# EAGLE design Logger (EAGLE 6.5.0)
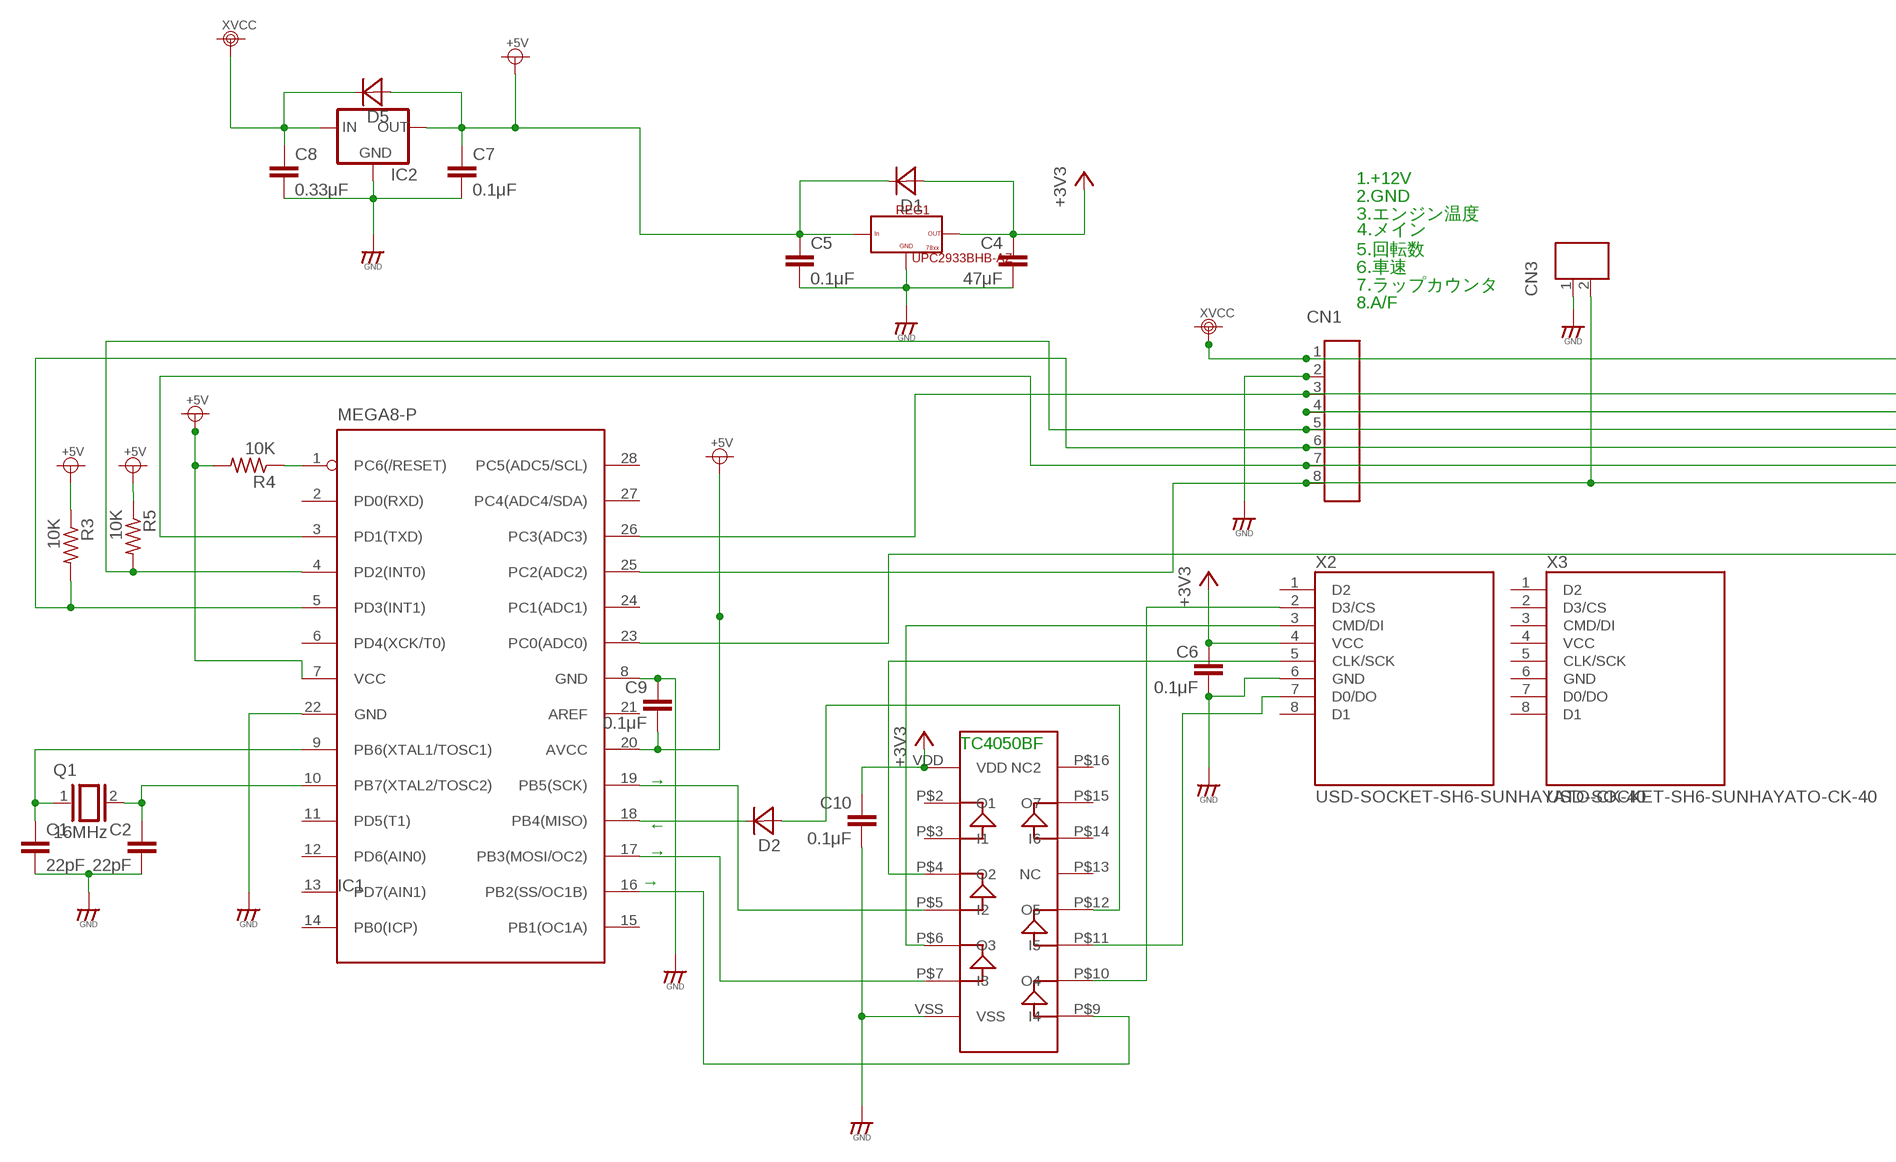
[diagram p0: schematic, sheet 1, part 1 of 2]
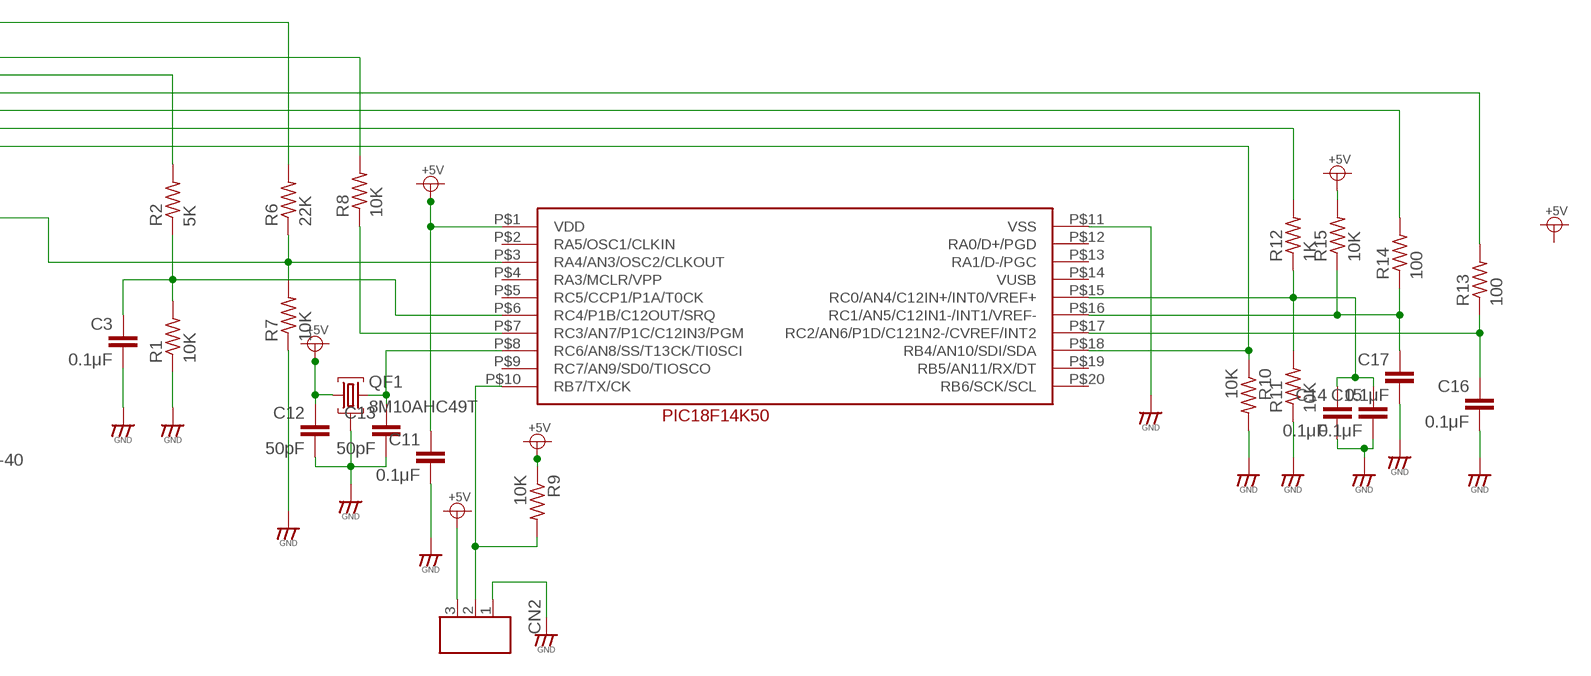
[diagram p1: schematic, sheet 1, part 2 of 2]

## Parts
C1  22pF  C-EU025-024X044  [C025-024X044]
C2  22pF  C-EU025-024X044  [C025-024X044]
C3  0.1μF  C-EU025-025X050  [C025-025X050]
C4  47μF  C-EU025-025X050  [C025-025X050]
C5  0.1μF  C-EU025-024X044  [C025-024X044]
C6  0.1μF  C-EU025-025X050  [C025-025X050]
C7  0.1μF  C-EU025-024X044  [C025-024X044]
C8  0.33μF  C-EU025-024X044  [C025-024X044]
C9  0.1μF  C-EU025-024X044  [C025-024X044]
C10  0.1μF  C-EU025-024X044  [C025-024X044]
C11  0.1μF  C-EU025-025X050  [C025-025X050]
C12  50pF  C-EU025-025X050  [C025-025X050]
C13  50pF  C-EU025-025X050  [C025-025X050]
C14  0.1μF  C-EU025-025X050  [C025-025X050]
C15  0.1μF  C-EU025-025X050  [C025-025X050]
C16  0.1μF  C-EU025-025X050  [C025-025X050]
C17  0.1μF  C-EU025-025X050  [C025-025X050]
CN1  CON_8P  [CON_HRS_DIP_8]
CN2  CON_3P  [CON_HRS_DIP_3]
CN3  CON_2P  [CON_HRS_DIP_2]
D1  DIODEGENERIC_2  [DIODE_2]
D2  DIODEGENERIC_2  [DIODE_2]
D5  DIODEGENERIC_2  [DIODE_2]
IC1  MEGA8-P  [DIL28-3]
IC2  78XX  [TO220-HORZ]
IC3  PIC18F14K50  [PIC18F14K50]
Q1  16MHz  XTAL/S  [QS]
QF1  8M10AHC49T  [HC49U]
R1  10K  R-US_0204/7  [0204/7]
R2  5K  R-US_0204/7  [0204/7]
R3  10K  R-US_0204/7  [0204/7]
R4  10K  R-US_0204/7  [0204/7]
R5  10K  R-US_0204/7  [0204/7]
R6  22K  R-US_0204/7  [0204/7]
R7  10K  R-US_0204/7  [0204/7]
R8  10K  R-US_0204/7  [0204/7]
R9  10K  R-US_0204/7  [0204/7]
R10  10K  R-US_0204/7  [0204/7]
R11  10K  R-US_0204/7  [0204/7]
R12  1K  R-US_0204/7  [0204/7]
R13  100  R-US_0204/7  [0204/7]
R14  100  R-US_0204/7  [0204/7]
R15  10K  R-US_0204/7  [0204/7]
REG1  UPC2933BHB-AZ  78XX  [78XX]
TC4050BF  HC4050  [HC4050]
X2  USD-SOCKET-SH6-SUNHAYATO-CK-40  [SUNHAYATO-CK-40]
X3  USD-SOCKET-SH6-SUNHAYATO-CK-40  [SUNHAYATO-CK-40]

## Nets
+3V3: C4.1 C6.1 C10.1 D1.A REG1.P$3 TC4050BF.VDD X2.4(VCC)
GND: C1.2 C2.2 C3.2 C4.2 C5.2 C6.2 C7.2 C8.2 C9.1 C10.2 C11.2 C12.2 C13.2 C14.2 C15.2 C16.2 C17.2 CN1.2 CN2.1 CN3.1 IC1.8(GND) IC1.22(GND) IC2.2(GND) IC3.P$11(VSS) QF1.2 R1.1 R7.1 R10.2 R11.1 REG1.P$2 TC4050BF.VSS X2.6(GND)
N$1: C1.1 IC1.9(PB6(XTAL1/TOSC1)) Q1.1
N$2: C2.1 IC1.10(PB7(XTAL2/TOSC2)) Q1.2
N$3: CN1.8 CN3.2 IC1.25(PC2(ADC2)) IC3.P$18(RB4/AN10/SDI/SDA) R10.1
N$4: CN1.6 IC1.5(PD3(INT1)) R3.2 R14.2
N$5: TC4050BF.P$10(O4) X2.2(D3/CS)
N$6: CN1.3 IC1.26(PC3(ADC3)) R8.2
N$7: C14.1 C15.1 IC3.P$15(RC0/AN4/C12IN+/INT0/VREF+) R11.2 R12.1
N$8: IC1.17(PB3(MOSI/OC2)) TC4050BF.P$7(I3)
N$9: C3.1 IC3.P$6(RC4/P1B/C12OUT/SRQ) R1.2 R2.1
N$10: TC4050BF.P$6(O3) X2.3(CMD/DI)
N$11: D2.K IC1.18(PB4(MISO))
N$12: D2.A TC4050BF.P$12(O5)
N$13: TC4050BF.P$11(I5) X2.7(D0/DO)
N$14: IC1.23(PC0(ADC0)) IC3.P$3(RA4/AN3/OSC2/CLKOUT) R6.1 R7.2
N$15: IC1.19(PB5(SCK)) TC4050BF.P$5(I2)
N$16: IC1.1(PC6(/RESET)) R4.1
N$17: TC4050BF.P$4(O2) X2.5(CLK/SCK)
N$18: IC1.16(PB2(SS/OC1B)) TC4050BF.P$9(I4)
N$19: CN1.5 IC1.4(PD2(INT0)) R5.2 R13.2
N$20: CN1.4 R2.2
N$21: IC3.P$7(RC3/AN7/P1C/C12IN3/PGM) R8.1
N$22: C13.1 IC3.P$8(RC6/AN8/SS/T13CK/TI0SCI) QF1.3
N$24: CN1.7 IC1.3(PD1(TXD)) R12.2
N$25: CN2.2 IC3.P$10(RB7/TX/CK) R9.2
N$26: C16.1 IC3.P$17(RC2/AN6/P1D/C121N2-/CVREF/INT2) R13.1
N$27: C17.1 IC3.P$16(RC1/AN5/C12IN1-/INT1/VREF-) R14.1 R15.1
VCC: C5.1 C7.1 C9.2 C11.1 C12.1 CN2.3 D1.K D5.A IC1.7(VCC) IC1.20(AVCC) IC2.3(OUT) IC3.P$1(VDD) QF1.1 R3.1 R4.2 R5.1 R9.1 R15.2 REG1.P$1 ; supply symbol labelled +5V
XVCC: C8.1 CN1.1 D5.K IC2.1(IN) R6.2
Unconnected: IC1.2(PD0(RXD)) IC1.6(PD4(XCK/T0)) IC1.11(PD5(T1)) IC1.12(PD6(AIN0)) IC1.13(PD7(AIN1)) IC1.14(PB0(ICP)) IC1.15(PB1(OC1A)) IC1.21(AREF) IC1.24(PC1(ADC1)) IC1.27(PC4(ADC4/SDA)) IC1.28(PC5(ADC5/SCL)) IC3.P$2(RA5/OSC1/CLKIN) IC3.P$5(RC5/CCP1/P1A/T0CK) IC3.P$9(RC7/AN9/SD0/TIOSCO) IC3.P$12(RA0/D+/PGD) IC3.P$13(RA1/D-/PGC) IC3.P$14(VUSB) IC3.P$19(RB5/AN11/RX/DT) IC3.P$20(RB6/SCK/SCL) TC4050BF.P$2(O1) TC4050BF.P$3(I1) TC4050BF.P$13(NC) TC4050BF.P$14(I6) TC4050BF.P$15(O7) TC4050BF.P$16(NC2) X2.1(D2) X2.8(D1) X3.1(D2) X3.2(D3/CS) X3.3(CMD/DI) X3.5(CLK/SCK) X3.7(D0/DO) X3.8(D1)

## Notes on the sheet
- 1.+12V
- 2.GND
- 3.エンジン温度
- 4.メイン
- 5.回転数
- 6.車速
- 7.ラップカウンタ
- 8.A/F
- TC4050BF
- →
- ←
- →
- →

## Power pins joined to a net without a drawn wire
+5V: X3.4(VCC)
GND: X3.6(GND)
RA3/MCLR/VPP: IC3.P$4(RA3/MCLR/VPP)

## Library data of the parts
C1-C17 = rcl:C-EU: CAPACITOR, European symbol
CN1 = da_parts:CON_8P
CN2 = da_parts:CON_3P
CN3 = da_parts:CON_2P
D1 D2 D5 = da_parts:DIODE
IC1 = atmel:MEGA8-P: MICROCONTROLLER 8 Kbytes FLASH, 1 kbytes SRAM, 512 bytes EEPROM, USART, 4-channel 10 bit ADC, 2-channel 8 bit ADC Pin compatible with Atmega48, ATMega88, ATMega168 Source: avr.lbr; OC_FARNELL: unknown; OC_NEWARK: unknown
IC2 = da_parts:78XX
IC3 = pic18f14k50:PIC18F14K50
Q1 = special:XTAL/S: CRYSTAL
QF1 = crystal-2:8M10AHC49T: Monolithic Crystal Filters Source: www.vanlong.com; OC_FARNELL: unknown; OC_NEWARK: unknown
R1-R15 = rcl:R-US_: RESISTOR, American symbol
REG1 = kitpcb:78XX
TC4050BF = HC4050BF:HC4050
X2 X3 = BS21Lab-SDcards:USD-SOCKET-SH6-: microSD Socket Push-push type uSD socket. Schematic element and footprint production proven. Spark Fun Electronics SKU : PRT-00127. tDoc lines correctly indicate media card edge positions when inserting (unlocked, locked, depressed).

## Board
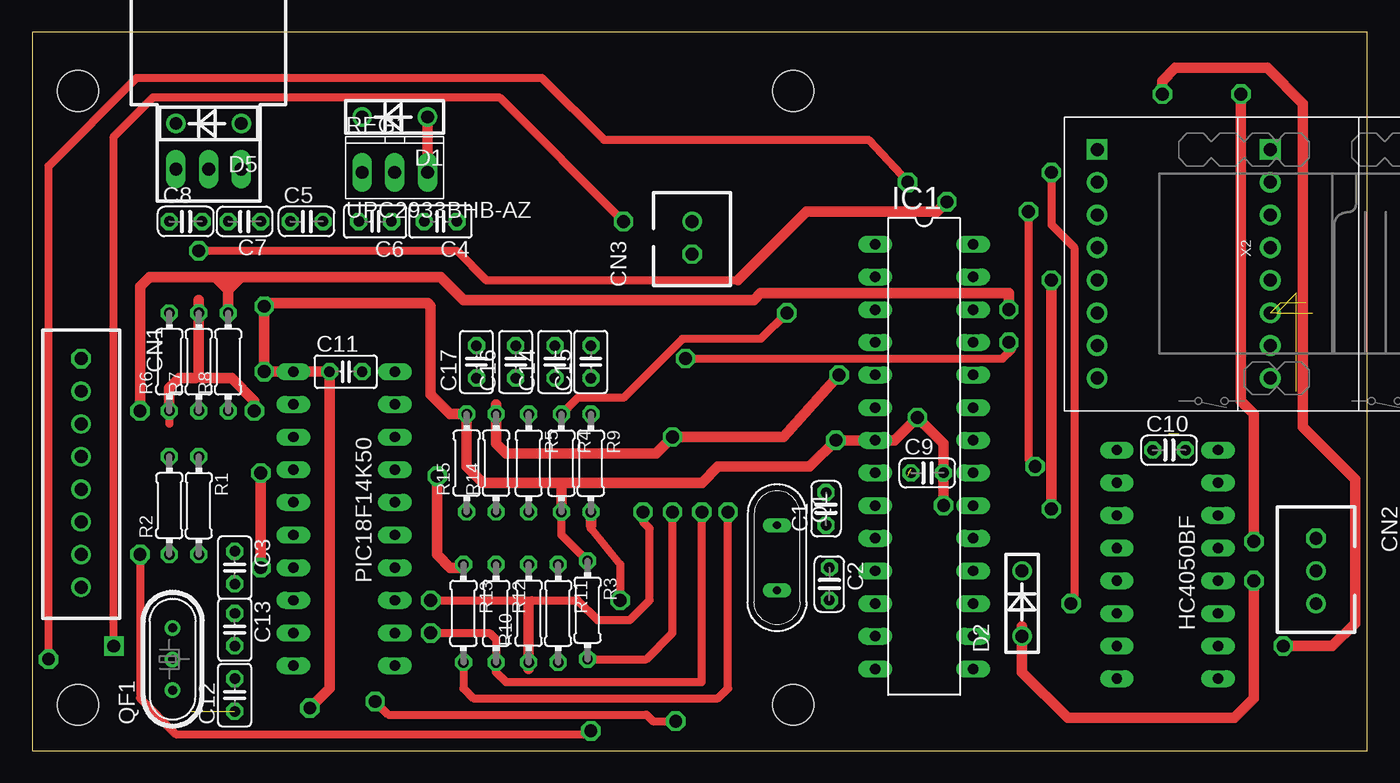
[diagram p2: board, top side]
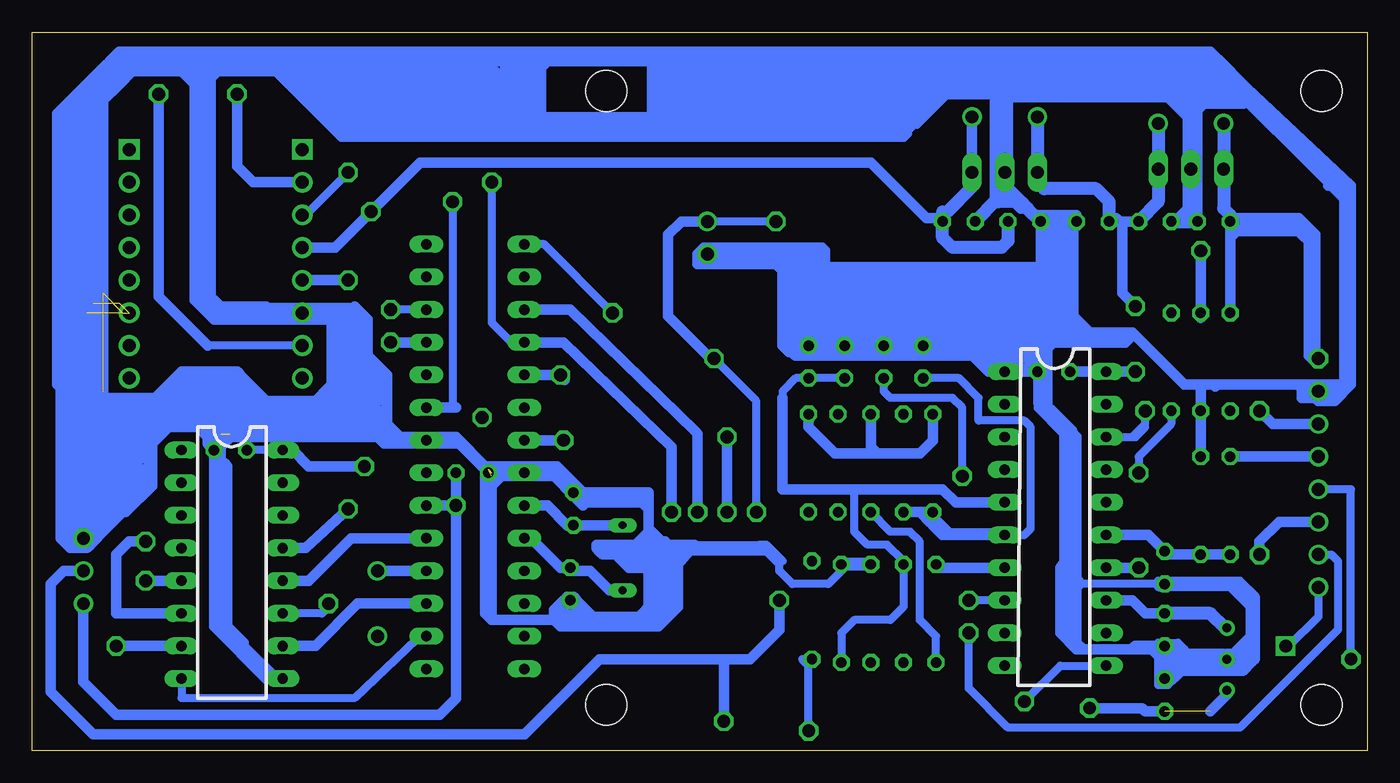
[diagram p3: board, bottom side, seen from below]

Size 103.81 x 55.87 mm. Coordinates in mm from the lower left corner, seen from the top.
Outline: 0,0 103.81,0 103.81,55.87 0,55.87 0,0
Copper layers (1*16): Top 0.035mm / dielectric 1.5mm / Bottom 0.035mm
Design rules "default": minimum track width 10mil, minimum drill 24mil, track to track 8mil, track to pad 8mil, pad to pad 8mil, via to via 8mil, smd to smd 8mil, copper to edge 40mil, drill to drill 8mil, minimum pad ring 10mil, minimum via ring 8mil, stop-mask expansion 4mil, vias tented up to drill 0mil, thermal gap 10mil
Holes 3.2 mm at 3.56,3.56 3.56,51.31 59.18,3.56 59.18,51.31

### Footprints (pad centres in the part's own frame; a part is rotated, then mirrored left to right if it is on the bottom)
C025-024X044 = drill 0.813 octagon: 1 -1.27,0; 2 1.27,0
C025-025X050 = drill 0.813 octagon: 1 -1.27,0; 2 1.27,0
CON_HRS_DIP_8 = drill 1 octagon: 1 -8.89,0 | drill 1: 2 -6.35,0; 3 -3.81,0; 4 -1.27,0; 5 1.27,0; 6 3.81,0; 7 6.35,0; 8 8.89,0
CON_HRS_DIP_3 = drill 1 octagon: 1 -2.54,0 | drill 1: 2 0,0; 3 2.54,0
CON_HRS_DIP_2 = drill 1 octagon: 1 -1.27,0 | drill 1: 2 1.27,0
DIODE_2 = drill 1: A -2.54,0; K 2.54,0
DIL28-3 = drill 0.813 long: 1 -16.51,-3.81; 2 -13.97,-3.81; 3 -11.43,-3.81; 4 -8.89,-3.81; 5 -6.35,-3.81; 6 -3.81,-3.81; 7 -1.27,-3.81; 8 1.27,-3.81; 9 3.81,-3.81; 10 6.35,-3.81; 11 8.89,-3.81; 12 11.43,-3.81; 13 13.97,-3.81; 14 16.51,-3.81; 15 16.51,3.81; 16 13.97,3.81; 17 11.43,3.81; 18 8.89,3.81; 19 6.35,3.81; 20 3.81,3.81; 21 1.27,3.81; 22 -1.27,3.81; 23 -3.81,3.81; 24 -6.35,3.81; 25 -8.89,3.81; 26 -11.43,3.81; 27 -13.97,3.81; 28 -16.51,3.81
TO220-HORZ = drill 1 long: 1 0,-2.54; 2 0,0; 3 0,2.54
PIC18F14K50 = drill 0.8 long: P$1 -5.08,10.16; P$2 -5.08,7.62; P$3 -5.08,5.08; P$4 -5.08,2.54; P$5 -5.08,0; P$6 -5.08,-2.54; P$7 -5.08,-5.08; P$8 -5.08,-7.62; P$9 -5.08,-10.16; P$10 -5.08,-12.7; P$11 2.794,10.16; P$12 2.794,7.62; P$13 2.794,5.08; P$14 2.794,2.54; P$15 2.794,0; P$16 2.794,-2.54; P$17 2.794,-5.08; P$18 2.794,-7.62; P$19 2.794,-10.16; P$20 2.794,-12.7
QS = drill 0.61 long: 1 -2.54,0; 2 2.54,0
HC49U = drill 0.7 pad 1.2: 1 -2.413,0; 2 -0.027,0; 3 2.413,0
0204/7 = drill 0.813 octagon: 1 -3.81,0; 2 3.81,0
78XX = drill 1 long: P$1 0,0; P$2 2.54,0; P$3 5.08,0
HC4050 = drill 0.8 long: P$2 -5.08,7.62; P$3 -5.08,5.08; P$4 -5.08,2.54; P$5 -5.08,0; P$6 -5.08,-2.54; P$7 -5.08,-5.08; P$9 2.794,-7.62; P$10 2.794,-5.08; P$11 2.794,-2.54; P$12 2.794,0; P$13 2.794,2.54; P$14 2.794,5.08; P$15 2.794,7.62; P$16 2.794,10.16; VDD -5.08,10.16; VSS -5.08,-7.62
SUNHAYATO-CK-40 = drill 1.016 pad 1.6 square: 1 0,0 | drill 1.016 pad 1.6: 2 2.54,0; 3 5.08,0; 4 7.62,0; 5 10.16,0; 6 12.7,0; 7 15.24,0; 8 17.78,0

### Placement (x,y rotation side)
C1  61.72,18.8 90 top
C2  61.98,12.95 270 top
C3  15.75,14.22 270 top
C4  31.75,41.15 180 top
C5  21.34,41.15 0 top
C6  26.67,41.15 180 top
C7  16.51,41.15 180 top
C8  11.94,41.15 0 top
C9  69.6,21.59 0 top
C10  88.39,23.37 0 top
C11  24.38,29.46 0 top
C12  15.75,4.32 90 top
C13  15.75,9.4 270 top
C14  40.64,30.23 90 top
C15  43.43,30.23 90 top
C16  37.59,30.23 90 top
C17  34.54,30.23 90 top
CN1  3.81,21.59 270 top
CN2  99.82,13.97 270 top
CN3  51.31,39.88 90 top
D1  28.19,49.28 180 top
D2  76.96,11.43 90 top
D5  13.72,48.77 180 top
IC1  69.34,22.86 270 top
IC2  13.72,45.21 270 top
IC3  25.4,19.3 0 top
Q1  57.91,14.99 270 top
QF1  10.92,7.11 90 top
R1  12.95,19.05 270 top
R2  10.67,19.05 90 top
R3  43.18,10.92 270 top
R4  41.15,22.35 270 top
R5  38.61,22.35 270 top
R6  10.67,30.23 90 top
R7  12.95,30.23 90 top
R8  15.24,30.23 90 top
R9  43.43,22.35 270 top
R10  38.61,10.67 90 top
R11  40.89,10.67 270 top
R12  36.07,10.67 270 top
R13  33.53,10.67 270 top
R14  36.07,22.35 90 top
R15  33.78,22.35 90 top
REG1  25.65,44.96 0 top
TC4050BF  89.41,13.21 0 top
X2  82.8,46.74 270 top
X3  96.27,46.74 270 top

### Tracks (layer width: path | path; a pad name or v marks a point on that pad's centre or on a via)
+3V3  (via drill 1)
  Top 0.61: v77.47,41.91 77.47,22.61 v77.98,22.1
  Top 0.813: REG1.P$3 D1.A
  Bottom 0.61: 83.57,23.37 TC4050BF.VDD C10.1
  Bottom 0.813: 33.02,41.91 32.51,41.91 30.73,43.69 D1.A | 30.99,45.72 30.99,43.69 33.02,41.66 C4.1 33.27,41.4 34.29,41.4 38.61,45.72 73.66,45.72 v77.47,41.91 80.26,39.12 X2.4 | v77.98,22.1 82.3,22.1 83.57,23.37
  Bottom 1.016: REG1.P$3 30.73,44.2 | 33.02,41.91 C4.1 33.02,39.88 32.26,39.12 28.45,39.12 27.94,39.62 C6.1
GND  (9 unrouted)
  Bottom 0.61: C13.2 15.49,8.13 14.99,7.62 11.18,7.62 10.67,7.11 11.43,6.35 | 11.43,6.35 11.68,6.35 | 14.48,6.35 15.49,6.35 | 11.43,6.35 10.92,6.35 | 10.92,6.35 9.65,7.62 | 10.92,7.62 9.65,7.62 | 9.65,7.62 9.14,8.13 9.14,11.18 10.67,12.7 14.48,12.7 | 14.48,12.7 14.48,13.21 10.67,13.21 8.89,11.43 8.89,9.14 | 9.14,7.11 9.91,6.35 10.41,6.35 | 10.92,6.35 10.41,6.35 | 10.41,6.35 9.14,7.62 8.89,7.37 | 8.89,7.37 8.89,6.86 | 8.89,6.86 9.65,6.1 14.22,6.1 | 14.48,6.1 14.99,6.1 14.99,5.59 | 14.99,5.59 15.49,5.08 | 15.49,5.08 16.26,5.08 16.26,7.37 16.26,8.38 14.73,8.38 14.22,7.87 14.22,6.1 | 14.22,6.1 14.48,6.1 | 14.48,6.1 14.99,5.59 | 15.49,5.08 15.49,5.33 14.48,6.35 | 14.48,6.35 11.68,6.35 | 11.68,6.35 8.89,9.14 | 8.89,9.14 8.89,7.37 | 8.89,7.37 9.14,7.11 | 9.14,7.11 8.89,6.86 | 8.89,6.86 8.64,7.11 8.64,11.94 9.91,13.21 16.26,13.21 16.26,12.7 15.49,12.7 | 14.48,12.7 15.49,12.7 | 15.49,12.7 C3.2 22.35,12.95 23.37,13.97 23.37,24.64 25.65,26.92 25.65,28.45 | 25.4,28.45 25.4,26.92 25.15,26.67 | 25.15,26.67 24.89,26.67 24.64,26.67 22.86,24.89 22.86,13.72 22.35,13.21 22.61,13.21 | 23.62,24.64 25.65,26.67 25.15,26.67 | 25.15,26.67 24.89,26.92 24.89,28.45 25.4,28.45 | 25.4,28.45 25.65,28.45 | 25.65,28.45 C11.2 | 52.32,16 47.24,16 | 45.47,14.73 46.74,16 47.24,16 | 47.24,16 46.74,15.49 | 53.09,15.49 46.74,15.49 | 46.74,15.49 45.72,14.48 45.72,13.97 44.7,12.95 41.91,12.95 40.89,13.97 R11.1 | 23.62,14.22 23.62,14.48 23.62,25.15 25.15,26.67 | 25.15,26.67 25.15,29.21 26.42,30.48 26.42,32.26 | 26.42,32.77 26.42,32.26 | 26.42,32.26 26.92,31.75 26.92,32 27.18,32.26 27.18,31.75 26.92,31.5 26.42,31.5 25.65,32.26 25.65,32.77 26.42,32.77 | 26.42,32.77 42.16,32.77 44.2,32.77 44.45,32.51 44.96,32 44.96,30.99 44.7,30.99
  Bottom 0.61: 72.14,48.26 79.5,48.26 84.58,53.34 85.34,53.34 | 42.42,37.85 42.42,34.29 42.42,31.75 | 85.6,34.54 78.74,34.54
  Bottom 0.813: C11.2 IC3.P$11 29.46,29.46 30.99,30.99 C16.2 | C16.2 C17.2 C14.2 C15.2 | 63.5,21.59 IC1.8 68.07,21.59 | 63.25,21.59 C1.2 60.96,20.07 | 60.96,20.07 55.88,20.07 55.88,18.8 | 55.37,10.92 55.37,10.41 55.88,9.91 61.21,9.91 61.72,10.41 | 61.72,10.41 61.72,11.43 | 61.72,11.43 C2.2 | 55.12,14.48 55.12,15.75 53.59,15.75 | 55.12,14.48 55.12,10.16 55.63,9.65 | 55.63,9.65 61.21,9.65 | 61.21,9.65 61.72,10.16 61.72,10.41 | 61.72,10.41 60.45,10.41 | 56.64,10.41 55.88,10.41 55.37,10.92 | 55.37,10.92 55.63,10.92 55.88,10.67 55.88,14.22 | 60.96,19.05 61.47,19.56 | 61.47,19.56 57.15,19.56 56.9,19.3 | 60.2,19.3 60.96,20.07 | 60.96,20.07 62.48,21.59 | 62.48,21.59 63.25,21.59 | 63.25,21.59 63.5,21.59 | 63.5,21.59 63.25,21.34 | 61.72,19.81 61.47,19.56 | 55.63,11.43 56.64,10.41 | 60.2,10.41 60.45,10.41 | 60.45,10.41 61.21,9.65 | 61.21,9.65 62.23,9.65 | 62.23,10.16 62.23,11.94 61.72,11.94 | 61.72,11.68 61.72,11.43 | 61.72,11.43 61.47,11.18 61.47,11.68 | 61.47,11.68 61.72,11.94 | 61.72,11.94 61.72,11.68 | 60.45,10.41 61.72,11.68 | 61.72,11.68 61.47,11.68 | 61.47,11.68 60.2,10.41 | 60.2,10.41 56.64,10.41 | 52.83,15.75 53.59,15.75 | 54.61,16.26 54.86,16 53.85,16 | 52.32,16 53.85,16 | 53.85,16 53.85,15.75 55.12,14.48 | 55.12,14.48 54.86,14.48 53.59,15.75 | 53.59,15.75 53.59,14.99 | 53.59,14.99 53.59,11.18 55.12,9.65 55.63,9.65 | 55.63,9.65 55.63,9.91 54.36,11.18 54.36,13.72 | 54.36,14.73 54.36,13.72 | 54.36,13.72 53.85,13.21 53.85,14.22 52.32,16 | 52.32,16 52.83,15.75 | 52.83,15.75 53.09,15.49 53.59,14.99 | 53.59,14.99 54.86,14.99 56.13,16.26 56.13,16 | 56.13,16 56.9,16 | 56.9,16 59.69,16 59.69,15.75 56.9,15.75 | 56.9,15.75 56.39,15.75 56.13,16 | 56.13,16 56.13,15.49 59.69,15.49
  Bottom 0.813: 59.69,15.49 59.94,15.75 59.94,16 57.4,16 56.13,14.73 56.13,14.99 56.9,15.75 | 56.9,15.75 55.88,16.76 | 55.88,16.76 55.88,14.22 | 55.88,14.22 57.4,14.22 58.17,14.99 57.4,14.99 57.15,14.73 | 57.15,14.73 56.64,14.73 | 57.15,14.73 57.91,14.73 58.42,15.24 59.44,15.24 59.69,15.49 | C7.2 14.99,41.15 13.97,42.16 13.97,49.28 16,51.31 26.92,51.31 | 27.43,51.82 27.94,51.31 27.94,50.55 | 27.43,51.82 27.18,51.82 | 27.18,51.82 15.75,51.82 | 15.75,51.82 13.72,49.78 13.72,41.66 C8.2 13.21,49.78 12.7,50.29 10.16,50.29 | 15.49,51.82 15.75,51.82 | 27.43,51.82 27.69,51.82 | 27.69,51.82 28.96,50.55 28.96,42.93 28.83,42.8 | 27.94,45.72 27.94,50.55 | 27.94,50.55 27.18,51.31 27.43,51.31 28.45,50.29 28.45,45.97 28.19,45.72 27.94,45.72 | 27.94,45.72 27.94,43.94 28.19,43.69 REG1.P$2 28.7,45.47 | 28.7,45.47 28.7,43.43 | 28.7,45.47 28.7,50.29 27.18,51.82 | 27.69,51.82 32.51,51.82 | 32.51,51.82 35.05,49.28 35.05,48.77 32.77,51.05 | 32.77,51.05 29.21,51.05 | 29.21,51.05 28.7,51.05 | 28.7,51.05 28.45,51.31 | 28.45,51.31 28.7,51.31 | 28.7,51.31 32,51.31 32.51,51.82 | 32.51,51.82 33.53,51.82 | 33.53,51.82 35.31,50.04 | 35.31,50.04 35.31,49.78 | 35.31,49.78 35.31,48.77 | C16.2 27.18,30.99 | 27.18,30.99 26.92,30.99 | 26.92,30.99 26.67,30.73 | 26.67,30.73 26.42,30.48 25.65,29.72 28.96,29.72 29.46,30.23 | 29.46,30.23 29.97,30.73 | 29.97,30.73 28.7,30.73 | 28.7,30.73 27.18,30.73 | 27.18,30.73 26.92,30.48 29.21,30.48 29.46,30.23 | 29.46,30.23 27.94,30.23 27.18,30.99 | 27.18,30.99 27.18,31.24 27.43,31.5 | 27.43,31.5 39.62,31.5 | 39.62,31.5 C15.2 | C15.2 43.69,31.24 43.69,31.75 | 43.69,31.75 43.18,31.75 | 43.18,31.75 42.42,31.75 39.88,31.75 | 39.88,31.75 27.69,31.75
  Bottom 0.813: 27.69,31.75 27.43,31.5 | 27.69,31.75 27.94,32 35.05,32 34.8,32.26 43.69,32.26 44.2,32.77 43.43,32.77 | TC4050BF.VSS 85.6,5.59 89.66,9.65 C10.2 88.14,24.89 | 82.55,25.15 87.88,25.15 | 87.88,25.15 88.14,24.89 | 97.28,22.86 95,25.15 | 90.42,25.15 87.88,25.15 | 95,25.15 94.23,25.15 | 90.93,25.15 90.42,25.15 | 90.42,25.15 90.17,24.89 90.17,24.64 | 90.17,24.38 90.17,23.88 89.92,23.62 89.41,24.13 89.41,24.38 | 89.41,24.38 89.15,24.64 89.66,24.64 | 88.14,24.89 89.92,24.89 90.17,24.64 | 90.17,24.64 90.17,24.38 | 90.17,24.38 90.93,25.15 | 95,25.15 95.5,25.15 | 95.5,25.15 97.28,23.37 97.28,22.86 | 99.57,21.34 99.82,21.08 CN2.1 99.31,17.02 99.31,20.83 97.28,22.86 | 68.07,21.59 C9.1 | C9.1 68.83,22.1 | 68.83,22.1 70.61,23.88 | 70.61,23.88 70.87,24.13 IC1.22 | 90.17,25.65 89.41,25.65 89.15,25.91 | 95.5,25.15 95,25.65 83.82,25.65 83.82,26.92 84.84,25.91 | 90.93,25.15 94.23,25.15 | 94.23,25.15 95,25.91 93.98,25.91 | 93.98,25.91 89.15,25.91 | 84.84,25.91 83.31,25.91 82.55,25.15 | 89.15,25.91 84.84,25.91 | 93.73,27.18 99.57,21.34 | 99.57,21.34 99.31,21.34 94.23,26.42 | 94.23,26.42 85.85,26.42 | 85.85,26.42 85.6,26.42 | 85.6,26.42 85.34,26.67 | 85.34,26.67 86.11,26.67 | 86.11,26.67 86.36,26.67 | 86.36,26.67 87.12,27.43 87.12,28.7 | 87.12,28.7 87.63,29.21 | 87.63,29.21 87.88,29.46 91.69,29.46 | 91.69,29.46 94.49,26.67 93.47,26.67 91.95,28.19 87.88,28.19 87.38,27.69 92.2,27.69 92.46,27.43 92.46,27.94 91.44,28.96 87.63,28.96 87.38,28.7 87.38,27.94 86.11,26.67 | 86.36,26.67 87.12,26.67 | 87.12,26.67 92.96,26.67 98.04,21.59 98.04,17.78 99.31,16.51 99.31,19.81 98.81,20.32 98.81,20.57 98.55,20.83 98.55,17.53 98.81,17.27 98.55,17.27 97.28,18.54 97.03,18.54
  Bottom 0.813: 97.03,18.54 96.52,18.54 94.49,20.57 94.49,24.38 | 94.49,24.89 94.49,24.38 | 94.49,24.38 97.54,21.34 97.54,18.03 97.79,18.03 99.82,16 99.31,16 | 99.31,16 98.04,17.27 | 98.04,17.27 96.52,18.8 96.52,19.3 94.74,21.08 94.74,23.11 95,23.11 97.03,21.08 97.03,19.81 | 97.03,18.54 97.03,19.81 | 97.03,19.81 96.27,20.57 96.27,20.83 95.25,21.84 95.25,21.08 95.76,20.57 95.76,22.61 92.96,25.4 95.5,25.4 100.08,20.83 100.08,19.81 | 100.08,16.51 100.08,19.81 | 100.08,19.81 93.98,25.91 | 77.98,33.02 78.49,33.53 | 83.06,26.42 85.6,26.42 | 94.23,26.42 98.55,26.42 | 98.55,26.42 99.06,26.42 | 99.06,26.42 99.82,26.42 101.85,28.45 101.85,49.53 98.04,53.34 97.79,53.34 | 97.79,53.34 85.34,53.34 | 72.14,48.26 35.81,48.26 | 35.81,48.26 35.31,48.77 | 1.78,42.93 3.56,44.7 | 10.41,51.56 10.16,51.56 | 10.16,51.56 9.65,51.56 | 9.4,51.56 1.27,43.94 1.27,29.21 | 3.3,44.7 2.03,44.2 3.05,43.94 | 3.3,44.7 3.56,44.7 | 3.56,44.7 10.41,51.56 | 10.41,51.56 10.92,52.07 | 10.92,52.07 10.16,52.07 | 10.16,52.07 9.91,52.07 | 9.91,52.07 9.4,51.56 | 9.4,51.56 9.65,51.56 | 9.65,51.56 10.16,52.07 | 10.92,52.07 33.27,52.07 | 33.27,52.07 33.53,51.82 | 9.65,50.29 10.16,50.29 | 10.16,50.29 10.67,50.8 13.21,50.8 13.72,50.29 13.72,50.55 14.73,51.56 | 14.73,51.56 10.92,51.56 | 10.92,51.56 10.41,51.05 | 10.41,51.05 13.72,51.05 | 10.41,51.05 10.16,51.05 | 3.3,44.7 10.16,51.56 | 10.41,51.56 10.92,51.56 | 14.73,51.56 15.24,51.05 28.7,51.05 | 55.88,16.76 55.63,16.76 55.12,16.26 55.12,16.51 | 55.12,16.51 55.88,17.27 | 55.88,17.27 55.88,18.8 | 60.2,19.3 56.39,19.3 55.88,18.8 | 60.71,19.3 60.2,19.3 | 55.88,17.27 55.88,17.02 56.9,16 | 56.13,16 55.63,16 55.12,16.51 | IC1.22 75.18,24.13 75.95,24.89 82.3,24.89 82.55,25.15
  Bottom 0.813: 83.06,26.92 83.06,26.42 | 83.06,26.42 82.3,25.65 76.71,25.65 76.2,25.15 76.2,26.16 77.47,26.16 | 77.47,26.16 82.3,26.16 | 82.3,26.16 82.55,26.42 76.2,26.42 76.2,27.18 76.45,27.18 | 76.2,27.94 76.2,27.43 76.45,27.18 | 76.2,27.94 78.49,27.94 78.49,27.69 75.18,24.38 | 76.2,28.7 76.2,27.94 | 76.45,27.18 76.45,28.45 76.2,28.7 | 76.2,28.7 76.2,28.96 76.45,28.96 76.2,29.21 77.72,30.73 77.72,33.53 78.23,34.04 | 78.23,33.78 78.23,30.73 | 78.74,30.99 78.74,31.5 78.99,31.75 80.26,31.75 78.49,33.53 | 78.49,33.53 78.23,33.78 | 78.23,33.78 78.23,34.04 | 78.23,34.04 78.74,34.54 | 86.11,33.53 86.11,34.29 85.85,34.54 85.85,34.29 85.6,34.54 85.6,34.04 | 71.12,24.38 70.87,24.38 68.58,22.1 | 68.07,21.59 68.07,21.34 | 68.07,21.34 67.31,21.34 | 67.31,21.34 63.25,21.34 | 63.25,21.34 61.72,19.81 | 61.72,19.81 61.72,20.32 62.48,21.08 | 68.07,21.34 67.82,21.08 68.33,21.08 68.58,21.34 68.58,10.92 67.82,10.16 | 68.07,21.34 C9.1 | IC1.22 75.44,24.13 75.69,24.38 | 75.69,24.38 77.47,26.16 | 82.3,26.16 92.2,26.16 93.47,27.43 | 91.69,29.46 92.2,29.46 95,26.67 99.57,26.67 99.82,26.92 | 3.05,43.94 1.78,43.69 1.78,42.93 | 1.78,42.93 1.78,28.7 | 1.78,28.7 2.03,28.45 | 2.03,28.45 2.54,27.94 3.3,27.94 3.3,27.18 | 3.3,27.18 2.54,27.18 1.27,28.45 1.27,29.21 | 1.27,29.21 1.78,28.7 | 2.03,28.45 4.32,28.45 | 4.32,28.45 4.32,28.19 | 4.32,28.19 CN1.2 | 4.32,28.19 4.32,27.69 | 4.32,27.69 3.81,27.18 3.3,27.18 | 4.32,27.69 4.57,27.94 4.57,28.45 | 4.57,28.45 4.32,28.45 | 4.57,28.45 5.08,28.45 5.08,28.19 | 3.56,27.43 5.08,27.43 5.08,28.19 | 43.94,30.73 43.94,31.24 43.69,31.5 C15.2 | 28.96,30.48 28.7,30.73 | 29.97,30.73 44.45,30.73 44.7,30.99 44.7,31.5 44.45,31.75 43.69,31.75
  Bottom 0.813: 39.88,31.75 39.62,31.5 | 5.08,28.19 5.33,28.45 11.68,28.45 11.81,28.32 11.94,28.45 12.7,28.45 | 44.7,31.75 44.2,32.26 45.47,32.26 | 99.82,26.92 101.6,28.7 101.6,49.53 98.04,53.09 | 97.79,53.34 97.79,53.09 | 97.79,53.09 100.84,50.04 | 100.84,50.04 101.09,49.78 101.09,27.94 101.6,28.45 101.6,16.51 100.84,15.75 99.57,15.75 99.31,16 | 98.04,17.27 99.82,17.27 100.58,16.51 100.84,16.76 100.84,26.92 | 100.84,26.92 101.35,27.43 | 100.84,26.92 100.08,26.16 100.08,21.08 99.57,21.59 99.57,25.91 99.31,26.16 99.06,26.16 98.81,25.91 98.81,23.11 99.31,22.61 99.06,22.61 98.3,23.37 98.3,25.91 98.04,26.16 97.54,26.16 97.54,24.13 | 97.54,24.13 97.79,23.88 | 97.54,24.13 97.28,24.38 97.28,25.91 96.01,25.91 | 95.25,25.91 96.01,25.91 | 96.01,25.91 97.03,24.89 97.54,24.89 99.06,26.42 | 99.06,26.42 99.82,27.18 | 99.82,27.18 99.82,27.69 | 99.82,27.69 100.33,28.19 100.33,50.29 100.08,50.55 99.82,50.55 99.31,51.05 99.31,50.55 99.82,50.04 99.82,33.78 | 99.82,27.18 99.82,26.92 | 99.82,26.92 95.25,26.92 95,27.18 94.74,27.18 94.49,27.43 99.06,27.43 99.31,27.69 99.31,50.8 98.04,52.07 98.04,51.31 98.81,50.55 98.81,27.94 98.3,27.94 98.3,51.56 | 98.3,51.56 98.3,51.82 97.28,52.83 97.28,51.56 | 97.28,51.56 98.04,50.8 | 97.28,51.56 95.76,53.09 | 95.76,53.09 96.77,53.09 | 96.77,53.09 97.03,52.83 | 92.2,52.83 90.42,52.83 90.42,34.54 | 90.42,34.54 89.92,34.54 89.92,35.05 | 89.92,53.09 89.92,35.05 | 89.92,35.05 90.42,34.54 | 90.42,34.54 90.42,34.29 89.66,33.53 88.14,33.53 | 86.87,33.53 86.87,34.04 89.41,34.04 89.41,34.29 89.66,34.54 86.11,34.54 86.11,33.78 86.36,33.53 86.87,33.53 | 86.87,33.53 88.14,33.53 | 88.14,33.53 89.66,35.05 89.92,35.05
  Bottom 0.813: 89.92,35.05 90.17,35.31 90.17,52.07 | 88.9,53.34 90.17,52.07 | 90.17,52.07 90.68,52.07 91.19,52.58 | 91.19,52.58 91.69,53.09 | 35.31,32.51 28.45,32.51 | 28.45,32.51 26.92,30.99 | 26.67,30.73 27.18,30.73 | 27.18,30.73 28.7,32.26 28.45,32.51 | 28.45,32.51 23.88,32.51 | 23.88,32.51 21.59,32.51 | 21.34,32.51 18.29,32.51 14.22,28.45 12.7,28.45 | 43.43,32.77 42.93,33.27 42.93,38.1 43.18,38.35 42.93,38.35 42.42,37.85 42.42,38.35 | 42.16,38.61 42.16,33.27 | 42.16,32.77 43.43,32.77 | 43.43,32.77 43.69,33.02 43.69,38.86 | 45.47,32.26 45.47,32.51 | 45.47,32.51 45.47,38.61 | 45.47,38.61 45.21,38.61 44.7,38.1 | 44.7,38.1 44.7,33.27 44.96,33.02 | 44.45,32.51 44.45,33.27 44.2,33.53 44.2,37.85 44.45,37.85 44.7,38.1 | CN3.1 45.47,38.61 | 44.7,38.61 42.16,38.61 | 42.16,38.61 42.16,38.86 42.42,39.12 51.56,39.12 52.07,38.61 52.07,37.85 45.97,37.85 45.21,37.08 45.21,32.77 45.47,32.51 | 45.47,32.26 45.47,31.5 44.96,30.99 43.94,30.99 43.18,31.75 | 98.04,53.09 97.28,53.85 84.58,53.85 | 84.58,53.85 84.33,53.85 | 84.33,53.85 79.25,48.77 78.74,48.77 | 78.74,48.77 77.72,48.77 | 77.72,48.77 76.45,48.77 | 76.45,48.77 72.9,48.77 | 72.14,48.77 65.02,48.77 | 65.02,48.77 36.32,48.77 35.31,49.78 | 35.31,50.04 35.31,50.29 33.53,52.07 34.04,52.07 36.58,49.53 55.37,49.53 55.63,49.28 37.34,49.28 36.07,50.55 54.61,50.55 | 54.61,50.55 54.86,50.29 | 54.86,50.29 55.88,49.28 | 55.88,49.28 56.64,48.51 56.13,48.51 54.36,50.29 37.34,50.29 37.08,50.04 36.58,50.04 34.54,52.07 | 34.54,52.07 33.27,52.07 | 34.54,52.07 34.8,52.07 | 34.8,52.07 35.56,51.31 | 36.58,50.29 35.56,51.31 | 35.56,51.31 53.85,51.31 | 53.85,51.31 54.1,51.05 | 53.59,51.56 53.09,52.07
  Bottom 0.813: 53.09,52.07 34.8,52.07 | 34.54,52.07 34.54,49.53 35.31,48.77 | 35.81,48.26 35.81,48.01 36.07,47.75 79.76,47.75 82.8,50.8 | 84.84,52.83 85.34,53.34 | 85.34,53.34 85.09,53.34 84.58,53.85 | 84.33,53.85 83.82,53.85 | 83.82,53.85 78.74,48.77 | 78.74,48.77 78.74,49.28 83.31,53.85 | 83.31,53.85 83.82,53.85 | 83.31,53.85 82.55,53.85 82.04,53.34 82.04,53.09 77.72,48.77 | 77.72,48.77 77.72,49.53 82.04,53.85 | 82.04,53.85 82.3,53.85 | 82.04,53.85 68.83,53.85 64.77,49.78 | 64.77,49.78 64.77,49.28 | 64.77,49.28 64.77,49.02 65.02,48.77 | 65.02,48.77 65.02,49.02 69.34,53.34 80.52,53.34 80.77,53.09 76.45,48.77 | 76.45,48.77 76.45,49.78 79.5,52.83 | 79.5,52.83 80.01,52.83 | 79.5,52.83 78.49,52.83 78.49,52.07 75.44,49.02 74.42,49.02 74.42,49.28 78.23,53.09 78.23,52.58 75.18,49.53 73.66,49.53 73.41,49.28 73.91,49.28 77.47,52.83 76.2,52.83 76.2,52.07 72.9,48.77 | 72.9,48.77 72.14,48.77 | 72.14,48.77 72.14,49.02 76.2,53.09 75.44,53.09 74.93,52.58 74.93,52.32 71.88,49.28 71.12,49.28 | 67.82,49.28 66.29,49.28 66.04,49.53 66.55,49.53 69.85,52.83 74.42,52.83 74.68,52.58 74.42,52.58 71.12,49.28 | 71.12,49.28 67.82,49.28 | 67.82,49.28 67.56,49.53 70.1,52.07 73.15,52.07 | 73.15,52.07 73.41,52.32 | 73.15,52.07 70.87,49.78 68.83,49.78 | 68.83,49.78 68.58,49.53 | 68.83,49.78 70.61,51.56 72.14,51.56 | 72.39,51.56 72.14,51.56 | 72.14,51.56 70.61,50.04 70.36,50.04 70.1,50.29 70.61,50.29 71.37,51.05 70.87,51.05 70.61,50.8 | 70.36,50.55 70.61,50.8 | 70.61,50.8 82.8,50.8 | 82.8,50.8 84.84,52.83 | 84.84,52.83 91.95,52.83 92.2,53.09 95.76,53.09 | 96.77,53.09 97.28,53.59 | 97.28,53.59 97.79,53.09 | 27.69,31.75 18.8,31.75 18.54,32 23.37,32 23.88,32.51
  Bottom 0.813: 23.88,32.51 23.88,40.39 23.62,40.64 | 23.62,40.64 23.88,40.64 | 23.88,40.64 24.38,40.64 24.38,32.77 | 24.38,32.77 23.37,32.77 | 23.37,32.77 23.11,32.77 22.86,33.02 22.86,33.78 | 22.86,35.56 22.86,40.39 23.11,40.39 23.11,33.02 23.37,32.77 | 24.38,32.77 25.15,32.77 25.4,33.02 25.15,33.27 25.15,40.13 24.89,40.39 25.15,40.39 25.4,40.64 25.4,33.78 26.42,32.77 22.86,32.77 22.35,32.26 21.59,32.26 21.34,32.51 | 21.34,32.51 21.59,32.51 | 21.59,32.51 22.86,33.78 | 22.86,33.78 22.86,35.56 | 22.86,35.56 24.89,37.59 41.91,37.59 41.91,36.83 25.91,36.83 25.65,37.08 25.65,36.58 26.16,36.07 41.66,36.07 41.91,36.32 41.91,35.56 41.66,35.31 26.16,35.31 25.91,35.56 25.91,35.05 42.16,35.05 42.67,34.54 42.42,34.29 25.91,34.29 25.91,33.53 26.42,33.02 41.91,33.02 42.16,32.77 | 42.16,32.77 42.16,33.27 | 42.16,33.27 41.91,33.53 26.42,33.53 26.16,33.78 40.64,33.78 44.96,38.1 | 3.05,43.94 3.05,44.96 8.89,50.8 28.96,50.8 29.21,51.05 | 32.77,51.05 54.1,51.05 | 54.1,51.05 54.61,50.55 | 55.88,49.28 64.77,49.28 | 64.77,49.28 68.33,49.28 68.58,49.02 79.25,49.02 83.31,53.09 98.04,53.09 | 85.6,34.04 86.11,33.53 | 86.11,33.53 78.49,33.53 | 85.6,34.04 X2.6 | X2.6 79.25,34.04 78.99,33.78 78.99,32 78.74,31.75 78.74,30.73 76.96,28.96 76.96,27.18 77.22,26.92 82.04,26.92 | 85.34,26.92 92.46,26.92 92.71,27.18 77.72,27.18 77.22,27.69 77.22,28.96 77.47,29.21 77.98,29.21 78.23,29.46 78.23,28.96 77.72,28.45 78.49,28.45 79.25,27.69 79.25,30.48 | 79.25,30.99 79.25,30.48 | 79.25,30.48 78.49,29.72 78.49,28.96 78.74,28.7 78.99,28.7 80.26,27.43 80.26,27.69 79.76,28.19 79.76,33.02 80.26,33.02 80.52,33.27 80.52,28.45
  Bottom 0.813: 80.52,27.94 80.52,28.45 | 80.52,28.45 82.04,26.92 | 82.04,26.92 85.34,26.92 | 85.34,26.92 87.12,28.7 | 87.63,29.21 87.63,27.18 87.12,26.67 | 85.34,26.67 81.28,26.67 79.5,28.45 79.5,33.02 80.77,34.29 | X2.6 90.17,34.04 91.19,35.05 91.19,51.82 | 91.19,51.82 91.19,52.58 | R1.1 R7.1 12.95,28.19 12.7,28.45 | 23.62,14.22 23.62,9.4 23.11,8.89 | 22.1,7.87 18.29,7.87 | 18.29,7.87 16.76,7.87 16.26,7.37 15.75,7.37 14.99,8.13 18.03,8.13 18.29,7.87 | 22.1,7.87 22.61,7.87 23.88,9.14 23.88,12.95 | 23.88,12.95 23.88,14.22 23.62,14.48 23.62,13.21 23.88,12.95 | 23.88,12.95 22.61,12.95 | 22.61,12.95 22.35,12.95 22.86,12.45 22.86,9.4 23.11,9.14 23.11,8.89 | 23.11,8.89 22.61,8.38 | 22.1,7.87 22.61,8.38 | 22.61,8.38 22.61,12.95 | 22.61,12.95 22.61,24.38 24.89,26.67 24.89,28.45 25.4,28.96 25.15,28.96 24.89,28.7 24.89,30.99 25.91,30.99 25.91,30.73 25.65,30.48 25.4,30.48 25.15,30.23 25.15,30.99 24.64,31.5 24.64,39.88 23.88,40.64 | 67.82,10.16 63.5,10.16 | 63.5,10.16 63.25,10.16 | 63.25,10.16 62.23,10.16 | 62.23,10.16 62.23,9.65 | 62.23,9.65 62.74,9.65 63.25,10.16 | 63.25,10.16 63.25,10.41 | 63.25,10.41 63.25,10.92 62.48,11.68 62.48,11.43 62.99,10.92 62.74,10.67 62.74,10.41 63.25,10.41 | 63.25,10.41 63.5,10.16 | 67.82,10.16 68.07,10.16 68.58,10.67 68.07,10.67 68.07,20.57 67.31,21.34 | 63.25,21.34 62.74,21.34 62.48,21.59 | 62.48,21.59 62.99,22.1 68.58,22.1 | 68.83,22.1 68.58,22.1 | 68.58,22.1 68.07,21.59 | 88.14,24.89 88.14,24.64 89.15,23.62 89.15,9.91 87.88,8.64 | 87.88,8.64 86.61,7.37 | 86.61,7.37 86.61,7.11 85.34,5.84 85.09,5.84 | 83.57,5.84 85.09,5.84 | 85.09,5.84 86.61,7.37 | 87.88,8.64 87.88,8.89 88.65,9.65 88.65,22.1 88.9,22.35 88.9,9.91 87.38,8.38 88.14,8.38 89.15,9.4 89.15,24.13 89.41,24.38
  Bottom 0.813: 89.41,24.38 87.88,24.38 85.85,26.42 | 83.06,26.42 78.99,26.42 | 78.99,26.42 76.45,23.88 70.61,23.88 | IC1.22 76.2,24.13 76.45,24.38 89.15,24.38 92.2,27.43 98.04,27.43 99.06,26.42 | 99.06,26.42 99.06,34.8 100.84,36.58 100.84,50.04 | 99.57,34.04 99.82,33.78 | 99.82,33.78 99.82,27.69 | 99.82,27.69 98.55,26.42 | 78.99,26.42 77.72,26.42 77.47,26.16 | 75.69,24.38 75.18,24.38 | 75.18,24.38 71.12,24.38 | 71.12,24.38 C9.1 | 91.19,51.82 92.2,52.83 | 92.2,52.83 97.03,52.83 | 97.03,52.83 98.3,51.56 | 23.62,40.64 23.37,40.64 22.61,41.4 22.61,41.66 25.91,41.66 26.42,42.16 26.92,42.16 28.19,43.43 28.19,50.8 28.7,51.31 | 28.45,51.31 10.67,51.31 9.91,52.07 | 9.91,52.07 11.18,53.34 | 11.18,52.58 52.58,52.58 | 52.58,52.58 52.83,52.32 | 52.83,52.32 53.09,52.07 | 53.59,51.56 12.19,51.56 11.18,52.58 | 11.18,52.58 11.18,53.34 | 11.18,53.34 12.19,54.36 | 12.19,54.36 12.19,53.85 | 12.19,53.85 12.19,53.34 11.94,53.09 52.07,53.09 | 52.07,53.09 52.58,52.58 | 14.22,52.32 13.72,52.32 12.19,53.85 | 12.19,53.85 51.31,53.85 52.07,53.09 | 52.83,52.32 14.22,52.32 | 14.22,52.32 12.19,54.36 | 12.19,54.36 53.59,54.36 | 62.99,54.36 97.03,54.36 97.79,53.59 52.83,53.59 | 52.83,53.59 51.82,53.59 51.31,54.1 64.01,54.1 64.26,53.85 64.26,49.78 64.77,49.28 | 64.77,49.78 64.77,50.8 67.06,53.09 65.02,53.09 65.02,51.82 64.77,51.56 64.77,52.07 65.28,52.58 65.79,52.58 | 66.04,52.58 65.79,52.58 | 65.79,52.58 65.28,52.07 65.28,53.09 65.02,53.34 64.01,53.34 62.99,54.36 | 62.99,54.36 53.59,54.36 | 53.59,54.36 52.83,53.59 | 52.83,53.59 52.83,52.58 53.09,52.32 53.09,52.07 | 53.59,51.56 53.85,51.31 | 53.85,51.31 53.85,52.58 53.34,53.09 54.1,53.09 54.1,50.8 54.61,50.8 54.61,52.83 55.12,53.34 55.12,50.55 54.86,50.29
  Bottom 0.813: 54.86,50.29 55.12,50.29 55.63,49.78 55.63,53.34 56.13,53.85 97.03,53.85 97.28,53.59
  Bottom 1.016: IC2.2 13.72,41.15 | 13.72,41.15 C8.2 | C7.2 13.72,41.15 | REG1.P$2 28.19,43.94 | 28.19,43.94 28.19,43.69 28.19,43.43 28.83,42.8 C4.2 | 26.92,42.67 28.19,43.94 | C5.2 C6.2 26.42,42.16 26.92,42.67 | 26.92,42.67 28.7,42.67 | QF1.2 15.72,7.08 | 15.72,7.08 15.75,7.11 C13.2 | C12.2 15.75,7.06 15.72,7.08 | R10.2 R11.1
N$1
  Bottom 0.813: Q1.1 C1.1 62.23,17.53 63.75,19.05 IC1.9 65.79,19.05
N$2
  Bottom 0.813: IC1.10 65.02,16.51 62.74,14.22 C2.1 61.72,13.97 60.45,13.97 58.93,12.45 Q1.2
N$3  (via drill 1)
  Top 0.61: v50.8,30.48 75.44,30.48 76.2,31.24 v75.95,31.75 | v30.99,11.68 38.86,11.68 | 38.86,11.68 38.61,11.43 | 38.86,11.68 42.42,11.68 43.94,10.16 46.48,10.16 48.01,11.68 48.01,17.27 47.5,17.78 v47.5,18.54 | v6.35,8.13 6.35,47.75 9.4,50.8 36.32,50.8 v45.97,41.15
  Top 0.813: 38.61,6.35 R10.1 38.61,11.43
  Bottom 0.61: v47.5,18.54 47.5,27.18 v50.8,30.48 | IC3.P$18 v30.99,11.68 | CN1.8 3.81,10.41 6.1,8.13 v6.35,8.13 | v45.97,41.15 CN3.2
  Bottom 0.813: IC1.25 v75.95,31.75 | v50.8,30.48 51.05,30.48 54.36,33.78 54.36,40.13 53.34,41.15 CN3.2
N$4  (via drill 1)
  Top 0.61: R3.2 47.75,7.11 49.78,9.14 v49.78,18.54 | v43.43,1.52 43.18,1.27 11.18,1.27 8.38,4.06 v8.38,15.24
  Top 0.813: v62.74,29.21 58.42,24.38 v49.78,24.38 48.51,23.11 36.83,23.11 36.07,23.88 R14.2 36.07,26.92
  Bottom 0.61: v43.43,1.52 43.43,6.6 43.94,7.11 R3.2
  Bottom 0.813: v49.78,18.54 v49.78,24.38 | IC1.5 62.78,29.21 62.4,28.83 62.4,28.87 v62.74,29.21 | CN1.6 6.86,17.78 8.38,16.26 v8.38,15.24
N$5  (via drill 1)
  Top 0.813: v97.28,8.13 101.09,8.13 102.87,9.91 102.87,21.08 98.81,25.15 98.81,50.29 96.01,53.09 88.9,53.09 87.88,52.07 v87.88,51.05
  Bottom 0.813: X2.2 86.61,44.2 87.88,45.47 v87.88,51.05 | TC4050BF.P$10 v97.28,8.13
N$6  (via drill 1)
  Top 0.813: v75.95,34.29 75.95,35.56 56.64,35.56 56.13,35.05 33.53,35.05 31.75,36.83 16.26,36.83 | 15.24,35.81 15.24,36.83 | 15.24,36.83 14.22,36.83 | 14.22,36.83 9.14,36.83 8.38,36.07 v8.38,26.42 | 15.24,35.81 14.22,36.83 | 15.24,36.83 16.26,36.83 | 16.26,36.83 15.24,35.81 | 15.24,35.81 R8.2
  Bottom 0.61: IC1.26 v75.95,34.29
  Bottom 0.813: CN1.3 7.37,25.4 v8.38,26.42
N$7
  Bottom 0.61: C14.1 C15.1 44.45,28.96 45.47,27.94 45.47,27.43 | 39.88,20.32 39.88,17.02 38.86,16 37.34,16 36.07,14.73 R12.1 36.07,11.18 37.08,10.16 39.88,10.16 40.89,9.14 R11.2
  Bottom 0.813: IC3.P$15 32,19.3 33.02,20.32 39.88,20.32 45.47,20.32 45.47,27.43
N$8
  Bottom 0.813: IC1.17 78.49,11.43 81.79,8.13 TC4050BF.P$7
N$9
  Bottom 0.813: IC3.P$6 17.02,16.76 C3.1 15.49,15.24 R1.2 R2.1
N$10  (via drill 1)
  Top 0.61: v79.25,44.96 79.25,40.89 81.03,39.12 81.03,11.68 v80.77,11.43
  Bottom 0.61: v80.77,11.43 80.77,11.18 81.28,10.67 TC4050BF.P$6 | X2.3 82.55,41.66 v79.25,44.96
N$11
  Bottom 0.813: IC1.18 D2.K
N$12  (via drill 1)
  Top 0.813: 76.96,9.65 D2.A 76.96,6.1 80.52,2.54 93.47,2.54 95,4.06 v95,13.21
  Bottom 0.813: v95,13.21 TC4050BF.P$12
N$13  (via drill 1)
  Top 0.813: v93.98,51.05 93.98,27.18 95,26.16 v95,16.26
  Bottom 0.61: X2.7 90.17,31.5
  Bottom 0.813: TC4050BF.P$11 97.28,10.67 97.28,15.24 96.27,16.26 v95,16.26 | 90.17,31.5 90.3,31.62 93.98,35.31 v93.98,51.05
N$14  (via drill 1)
  Top 0.61: 10.67,25.4 R6.1 10.67,26.92 | v12.95,38.86 33.02,38.86 35.31,36.58 54.86,36.58
  Top 0.813: 12.95,29.21 R7.2 12.95,35.05 | 10.67,26.92 10.67,28.19 11.43,28.96 12.7,28.96 12.95,29.21 | v17.27,26.42 17.27,27.18 15.49,28.96 13.21,28.96 12.95,29.21 | 54.86,36.58 60.2,41.91 70.36,41.91 v71.12,42.67
  Bottom 0.61: 12.95,33.53 R7.2 | 19.81,24.38 18.29,24.38 | 18.29,24.38 18.03,24.38 17.27,25.15 | 18.29,24.38 17.27,25.4 v17.27,26.42 | v71.12,42.67 71.12,26.67
  Bottom 0.813: IC1.23 71.12,26.67 70.87,26.67 | v12.95,38.86 R7.2 | IC3.P$3 19.81,24.38
N$15
  Bottom 0.813: IC1.19 78.99,16.51 82.3,13.21 TC4050BF.P$5
N$16  (via drill 1)
  Top 0.61: v58.67,34.04 56.64,32 50.55,32 45.97,27.43 42.42,27.43 R4.1
  Bottom 0.61: v58.67,34.04 64.01,39.37 IC1.1
N$17  (via drill 1)
  Top 0.813: v79.25,18.8 v79.25,36.58
  Bottom 0.813: TC4050BF.P$4 82.55,15.75 v79.25,18.8 | v79.25,36.58 X2.5
N$18
  Bottom 0.61: 73.91,8.89 73.91,8.64 78.74,4.06 92.2,4.06 TC4050BF.P$9
  Bottom 0.813: IC1.16 73.91,8.89
N$19  (via drill 1)
  Top 0.61: R13.2 33.53,4.83 34.29,4.06 53.34,4.06 54.1,4.83 v54.1,18.54 | v68.07,44.2 65.02,47.5 44.45,47.5 39.62,52.32 8.13,52.32 1.27,45.47 v1.27,7.11
  Bottom 0.61: R5.2 37.08,17.02 35.56,17.02 34.8,16.26 34.8,10.16 33.53,8.89 R13.2 | v68.07,44.2 68.07,33.27 66.55,31.75 IC1.4 | v1.27,7.11 1.27,20.32 CN1.5
  Bottom 0.813: v54.1,18.54 54.1,23.62 62.48,31.75 IC1.4
N$20
  Bottom 0.813: CN1.4 R2.2
N$21  (via drill 1)
  Top 0.813: v17.78,21.59 v17.78,14.22
  Bottom 0.61: R8.1 15.24,25.4 17.78,22.86 v17.78,21.59
  Bottom 0.813: IC3.P$7 v17.78,14.22
N$22
  Bottom 0.813: IC3.P$8 18.29,11.68 17.27,10.67 C13.1
  Bottom 1.016: QF1.3 11.05,9.53 12.19,10.67 C13.1
N$24  (via drill 1)
  Top 0.61: v52.07,18.54 52.07,5.33 36.83,5.33 36.07,6.1 R12.2 36.07,8.64 35.56,9.14 v30.99,9.14
  Bottom 0.61: CN1.7 2.79,15.24 2.29,14.73 2.29,9.4 9.91,1.78 27.94,1.78 30.99,4.83 v30.99,9.14
  Bottom 0.813: 52.07,24.64 52.2,24.77 | 52.2,24.77 61.98,34.29 IC1.3 | v52.07,18.54 52.07,24.64 52.2,24.77
N$25  (via drill 1)
  Top 0.61: 43.43,17.53 43.43,17.27 45.72,14.48 v45.72,11.68 | v26.67,3.81 27.69,2.79 47.75,2.79 48.26,2.29 v50.04,2.29
  Top 0.813: R9.2 43.43,17.53
  Bottom 0.61: v26.67,3.81 23.88,6.6 IC3.P$10
  Bottom 0.813: CN2.2 101.35,13.97 102.36,12.95 102.36,4.57 99.06,1.27 65.53,1.27 59.69,7.11 50.04,7.11 | v45.72,11.68 45.72,9.4 48.01,7.11 50.04,7.11 | v50.04,2.29 50.04,7.11
N$26  (via drill 1)
  Top 0.813: v31.5,21.34 31.5,15.24 32.51,14.22 33.27,14.22 R13.1
  Bottom 0.61: v31.5,21.34 31.5,26.67 32.26,27.43 37.08,27.43 37.59,27.94 C16.1 | 33.27,14.22 R13.1
  Bottom 0.813: IC3.P$17 33.53,14.22 R13.1
N$27
  Bottom 0.61: R14.1 34.04,18.54 32.51,17.02 27.43,17.02 27.18,16.76 | 27.18,16.76 28.45,16.76 | 27.18,16.76 26.67,16.76 26.16,17.27 26.16,25.15 26.67,25.65 30.23,25.65 30.23,27.43 31.75,28.96 C17.1
  Bottom 0.813: IC3.P$16 28.45,16.76 33.02,16.76 33.78,17.53 R15.1 34.54,18.54 | 34.54,18.54 34.04,18.03 34.04,17.78 34.8,18.54 R14.1 34.54,18.54
VCC  (via drill 1)  (1 unrouted)
  Top 0.61: R4.2 41.15,16.76 R3.1
  Top 0.813: v21.59,3.3 23.11,4.83 C11.1 v18.03,29.46 v18.03,34.54 18.29,34.8 30.73,34.8 30.99,34.54 30.99,27.69 32.51,26.16 R15.2 33.78,22.1 35.05,20.83 41.4,20.83 | R4.2 41.15,20.57 41.4,20.83 | 41.4,20.83 52.07,20.83 53.34,22.1 60.45,22.1 v62.48,24.13 67.06,24.13 v68.83,25.91 70.87,23.88 v70.87,19.05 | IC1.20 72.64,19.05
  Bottom 0.61: R4.2 40.89,18.54
  Bottom 0.813: 66.04,24.13 IC1.7 v62.48,24.13 | C11.1 IC3.P$1 v18.03,29.46 | 38.1,23.11 38.61,23.62 R5.1 | 38.1,23.11 34.8,23.11 33.78,24.13 R15.2 | 38.1,23.11 41.4,23.11 43.43,25.15 R9.1 | C7.1 19.3,41.15 | 19.3,41.15 19.56,41.4 19.81,41.4 C5.1 19.3,41.15 | 19.3,41.15 19.05,40.89 19.05,35.56 v18.03,34.54 | QF1.1 10.92,4.32 12.19,3.05 | v21.59,3.3 17.53,3.3 17.27,3.05 C12.1 | 72.14,19.05 IC1.20 v70.87,19.05 | v70.87,19.05 C9.2 | CN2.3 99.82,5.33 97.28,2.79 72.14,2.79 70.87,4.06 v70.87,19.05
  Bottom 1.016: D5.A IC2.3 16.26,42.67 C7.1 | C5.1 20.07,42.67 21.08,43.69 25.15,43.69 25.4,43.94 25.4,44.2 25.65,44.45 REG1.P$1 D1.K
XVCC
  Bottom 0.813: 4.06,39.37 4.06,39.88 5.08,40.89 5.08,40.39 | 5.08,40.39 4.06,39.37 | 4.06,39.37 4.57,39.37 4.57,30.73 4.06,30.23 | 4.06,30.23 4.06,39.12 5.59,40.64 | 5.59,40.64 5.59,40.89 | 5.59,40.89 5.33,41.15 | 5.33,41.15 8.89,41.15 | 8.89,41.15 8.89,40.64 5.59,40.64 | 5.59,40.89 5.59,41.15 | 5.59,41.15 5.33,41.4 | 5.33,41.4 9.4,41.4 | 9.4,41.4 9.4,40.89 9.14,40.64 6.1,40.64 5.59,41.15 | 5.33,41.4 4.06,40.13 4.32,40.13 5.33,41.15 | 8.89,41.15 9.14,41.15 9.4,41.4 | 9.4,41.4 10.41,41.4 C8.1 10.67,40.39 9.65,40.39 | 5.08,40.39 9.65,40.39 | 9.65,40.39 10.16,40.89 10.16,40.39 10.41,40.13 10.67,40.13 R6.2 | 4.06,30.23 CN1.1
  Bottom 1.016: C8.1 10.67,41.66 11.18,42.16 IC2.1 D5.K